# EAGLE schematic VoltSensor (EAGLE 8.2.2)
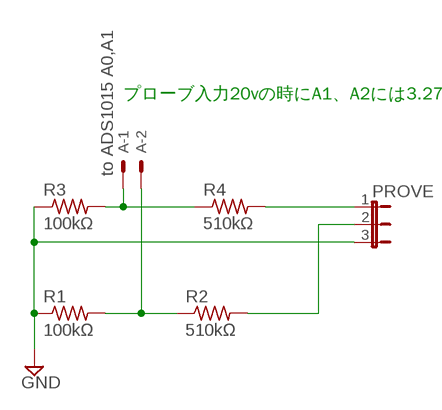
[diagram p0: schematic, sheet 1]

## Parts
A  to ADS1015 A0,A1  22-23-2021  [22-23-2021]
PROVE  JP2E  [JP2]
R1  100kΩ  R-US_M1206  [M1206]
R2  510kΩ  R-US_M1206  [M1206]
R3  100kΩ  R-US_M1206  [M1206]
R4  510kΩ  R-US_M1206  [M1206]

## Nets
N$1: A.1 R3.2 R4.1
N$2: A.2 R1.2 R2.1
N$3: PROVE.1 R4.2
N$4: PROVE.2 R2.2
PE: PROVE.3 R1.1 R3.1 ; supply symbol labelled GND

## Notes on the sheet
- プローブ入力20vの時にA1、A2には3.27Vが出る

## Library data of the parts
A = con-molex:22-23-2021: .100" (2.54mm) Center Header - 2 Pin; MF: MOLEX; MPN: 22-23-2021; OC_FARNELL: 1462926; OC_NEWARK: 25C3832
PROVE = jumper:JP2E: JUMPER
R1-R4 = resistor:R-US_: RESISTOR, American symbol